# Altium schematic sheet systems_pcb.SchDoc
size A4; DocumentNumber: 1; SheetNumber: 1; SheetTotal: 5
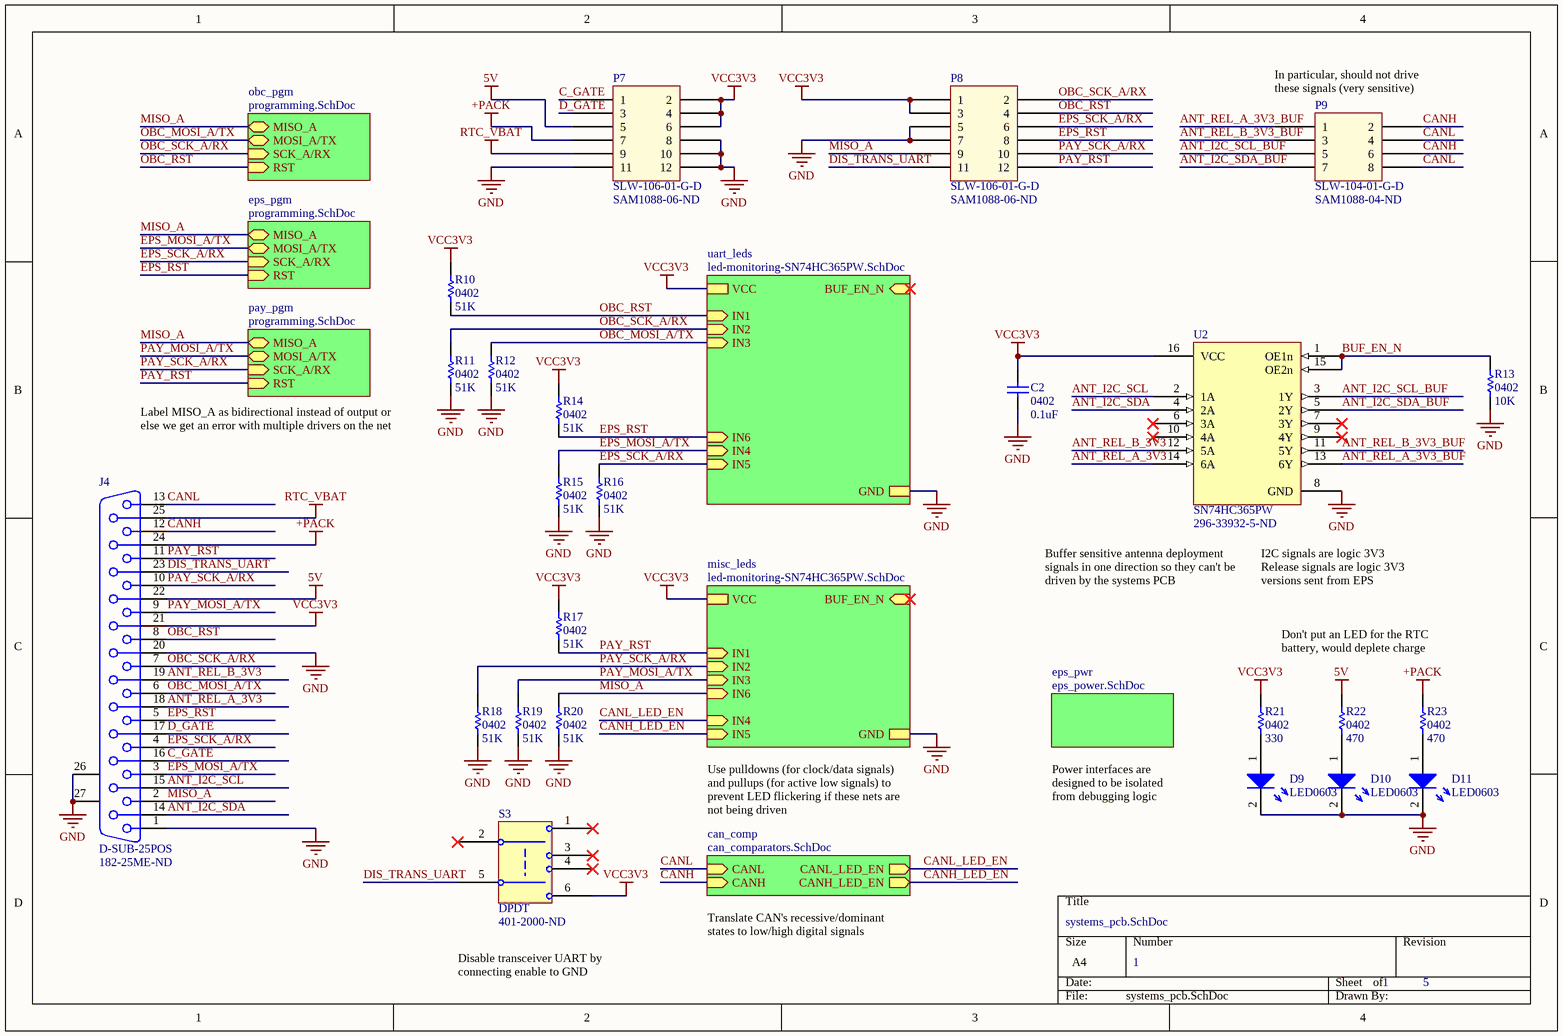
[diagram p0: systems_pcb.SchDoc]

## Parts
C2  0402  value 0.1uF  [CAP0402R]
D9  LED0603  [LED0603]
D10  LED0603  [LED0603]
D11  LED0603  [LED0603]
J4  D-SUB-25POS  Supplier Part Number 1: 182-25ME-ND  [D-SUB-25POS]
P7  SLW-106-01-G-D  Supplier Part Number 1: SAM1088-06-ND  [SLW-106-01-X-D]
P8  SLW-106-01-G-D  Supplier Part Number 1: SAM1088-06-ND  [SLW-106-01-X-D]
P9  SLW-104-01-G-D  Supplier Part Number 1: SAM1088-04-ND  [SLW-104-01-X-D]
R10  0402  value 51K  [RES0402R]
R11  0402  value 51K  [RES0402R]
R12  0402  value 51K  [RES0402R]
R13  0402  value 10K  [RES0402R]
R14  0402  value 51K  [RES0402R]
R15  0402  value 51K  [RES0402R]
R16  0402  value 51K  [RES0402R]
R17  0402  value 51K  [RES0402R]
R18  0402  value 51K  [RES0402R]
R19  0402  value 51K  [RES0402R]
R20  0402  value 51K  [RES0402R]
R21  0402  value 330  [RES0402R]
R22  0402  value 470  [RES0402R]
R23  0402  value 470  [RES0402R]
S3  DPDT  Supplier Part Number 1: 401-2000-ND  [JS202011AQN - Slide Switch]
U2  SN74HC365PW  Supplier Part Number 1: 296-33932-5-ND  [SOP65P640X120-16N]

## Sub-sheets
can_comp = can_comparators.SchDoc: CANL_LED_EN (out), CANH (in), CANH_LED_EN (out), CANL (in)
eps_pgm = programming.SchDoc: MISO_A (bidir), MOSI_A/TX (bidir), SCK_A/RX (in), RST (in)
eps_pwr = eps_power.SchDoc: no entries
misc_leds = led-monitoring-SN74HC365PW.SchDoc: VCC, GND, BUF_EN_N (in), IN1 (in), IN2 (in), IN3 (in), IN4 (in), IN5 (in), IN6 (in)
obc_pgm = programming.SchDoc: MISO_A (bidir), MOSI_A/TX (bidir), SCK_A/RX (in), RST (in)
pay_pgm = programming.SchDoc: MISO_A (bidir), MOSI_A/TX (bidir), SCK_A/RX (in), RST (in)
uart_leds = led-monitoring-SN74HC365PW.SchDoc: VCC, GND, BUF_EN_N (in), IN1 (in), IN2 (in), IN3 (in), IN4 (in), IN5 (in), IN6 (in)

## Nets
5V: J4.22 P7.5 R22.2
+PACK: J4.24 P7.7 R23.2
GND: C2.1 D9.2 D10.2 D11.2 J4.1 J4.20 J4.26(MH1) J4.27(MH2) P7.8 P7.10 P7.11 P7.12 P8.5 P8.7 R11.1 R12.1 R13.1 R15.1 R16.1 R18.1 R19.1 R20.1 U2.8(GND) ; sheet uart_leds/GND, sheet misc_leds/GND
RTC_VBAT: J4.25 P7.9
VCC3V3: C2.2 J4.21 P7.2 P7.4 P7.6 P8.1 P8.3 R10.2 R14.2 R17.2 R21.2 S3.6(POLE2B) U2.16(VCC) ; sheet uart_leds/VCC, sheet misc_leds/VCC
ANT_I2C_SCL: J4.15 U2.2(1A)
ANT_I2C_SCL_BUF: P9.5 U2.3(1Y)
ANT_I2C_SDA: J4.14 U2.4(2A)
ANT_I2C_SDA_BUF: P9.7 U2.5(2Y)
ANT_REL_A_3V3: J4.18 U2.14(6A)
ANT_REL_A_3V3_BUF: P9.1 U2.13(6Y)
ANT_REL_B_3V3: J4.19 U2.12(5A)
ANT_REL_B_3V3_BUF: P9.3 U2.11(5Y)
BUF_EN_N: R13.2 U2.1(OE1n) U2.15(OE2n)
C_GATE: J4.16 P7.1
CANH: J4.12 P9.2 P9.6 ; sheet can_comp/CANH
CANH_LED_EN: sheet misc_leds/IN5, sheet can_comp/CANH_LED_EN
CANL: J4.13 P9.4 P9.8 ; sheet can_comp/CANL
CANL_LED_EN: sheet misc_leds/IN4, sheet can_comp/CANL_LED_EN
D_GATE: J4.17 P7.3
DIS_TRANS_UART: J4.23 P8.11 S3.5(POLE2)
EPS_MOSI_A/TX: J4.3 R15.2 ; sheet eps_pgm/MOSI_A/TX, sheet uart_leds/IN4
EPS_RST: J4.5 P8.8 R14.1 ; sheet eps_pgm/RST, sheet uart_leds/IN6
EPS_SCK_A/RX: J4.4 P8.6 R16.2 ; sheet eps_pgm/SCK_A/RX, sheet uart_leds/IN5
MISO_A: J4.2 P8.9 R20.2 ; sheet obc_pgm/MISO_A, sheet eps_pgm/MISO_A, sheet pay_pgm/MISO_A, sheet misc_leds/IN6
OBC_MOSI_A/TX: J4.6 R12.2 ; sheet obc_pgm/MOSI_A/TX, sheet uart_leds/IN3
OBC_RST: J4.8 P8.4 R10.1 ; sheet obc_pgm/RST, sheet uart_leds/IN1
OBC_SCK_A/RX: J4.7 P8.2 R11.2 ; sheet obc_pgm/SCK_A/RX, sheet uart_leds/IN2
PAY_MOSI_A/TX: J4.9 R19.2 ; sheet pay_pgm/MOSI_A/TX, sheet misc_leds/IN3
PAY_RST: J4.11 P8.12 R17.1 ; sheet pay_pgm/RST, sheet misc_leds/IN1
PAY_SCK_A/RX: J4.10 P8.10 R18.2 ; sheet pay_pgm/SCK_A/RX, sheet misc_leds/IN2
NetD9_1: D9.1 R21.1
NetD10_1: D10.1 R22.1
NetD11_1: D11.1 R23.1

Not connected (* = marked no-connect by the designer): S3 1(POLE1A)* 2(POLE1)* 3(POLE1B)* 4(POLE2A)*; U2 6(3A)* 7(3Y)* 9(4Y)* 10(4A)*

## Notes on the sheet
- (near P9) In particular, should not drive these signals (very sensitive)
- Label MISO_A as bidirectional instead of output or else we get an error with multiple drivers on the net
- Buffer sensitive antenna deployment signals in one direction so they can't be driven by the systems PCB
- I2C signals are logic 3V3
  Release signals are logic 3V3 versions sent from EPS
- Don't put an LED for the RTC battery, would deplete charge
- Use pulldowns (for clock/data signals) and pullups (for active low signals) to prevent LED flickering if these nets are not being driven
- Power interfaces are designed to be isolated from debugging logic
- Disable transceiver UART by connecting enable to GND
- Translate CAN's recessive/dominant states to low/high digital signals

## Library data of the parts
C2 = CAP0402: 0402 capacitor; Manufacturer: Taiyo Yuden; Manufacturer Part Number: EMK105B7104KVHF; Voltage Rating: 16V; Capacitance: 100nF; Tolerance: 10%; Dielectric: X7R; Supplier 1: Digi-Key; Supplier Part Number 1: 587-3807-1-ND; Stock 1: 18196; Pricing 1: 1=0.1, 10=0.057, 100=0.0254, 500=0.01812, 1000=0.01423, 2500=0.01294, 5000=0.0119 (USD); Mount: Surface Mount; Case/Package: 0402; Weight: 2.3E-05oz; Case Code (Metric): 1005; Case Code (Imperial): 0402; Min Operating Temperature: -55°C; Max Operating Temperature: 125°C; Package Quantity: 10000; Packaging: Tape and Reel; Termination: SMD/SMT; Voltage Rating (DC): 16V; Length: 0.039inch; Height: 0.5mm; Width: 0.02inch; Thickness: 0.022inch; Ratings: AEC-Q200; Lead Free: Lead Free; Halogen Free: Halogen Free
D9-D11 = LED0603: Generic 0603 LED. Use ChipLED from Osram for generic ones.
J4 = D-SUB-25POS: CONN D-SUB PLUG 25POS R/A SOLDER; Supplier 1: Digi-Key; ComponentLink1Description: Datasheet; ComponentLink1URL: https://www.norcomp.net/rohspdfs/Connectors/18Y/182/182-yyy-113Ryy1.pdf
P7 P8 = SLW-106-01-G-D: CONN RCPT 12POS 0.1 GOLD PCB; Supplier 1: Digi-Key
P9 = SLW-104-01-G-D: CONN RCPT 8POS 0.1 GOLD PCB; Supplier 1: Digi-Key; ComponentLink1Description: Series Datasheet; ComponentLink1URL: http://suddendocs.samtec.com/prints/slw-1xx-01-x-x-mkt.pdf
R10-R12 R14-R23 = RES0402: 0402 resistor
R13 = RES0402: 0402 resistor; Manufacturer: Panasonic; Manufacturer Part Number: ERJ-2RKF1002X; Resistance: 10kR; Power Rating: 100mW; Tolerance: 1%; Voltage Rating: 50V; Temperature Coefficient: 100ppm/°C; Supplier 1: Digi-Key; Supplier Part Number 1: P10.0KLCT-ND; Stock 1: 14350001; Pricing 1: 1=0.1, 10=0.045, 100=0.0183, 1000=0.00823, 2500=0.00715, 5000=0.0059 (USD); Mount: Surface Mount; Case/Package: 0402; Number of Pins: 2; Case Code (Metric): 1005; Case Code (Imperial): 0402; Contact Plating: Tin; Min Operating Temperature: -55°C; Max Operating Temperature: 155°C; Packaging: Tape and Reel; Package Quantity: 1; Composition: Thick Film; Number of Terminations: 2; Termination: SMD/SMT; Military Standard: Not; Max Power Dissipation: 100mW; Voltage Rating (DC): 50V; Features: Automotive AEC-Q200; Length: 1mm; Height: 0.35mm; Width: 0.02inch; Depth: 0.5mm; Radiation Hardening: No; REACH SVHC: No SVHC; Lead Free: Lead Free; ComponentLink1URL: http://industrial.panasonic.com/www-data/pdf/AOA0000/AOA0000CE2.pdf?src-supplier=Future+Electronics; ComponentLink1Description: http://industrial.panasonic.com/www-data/pdf/AOA0000/AOA0000CE2.pdf?src-supplier=Future+Electronics; ComponentLink2URL: http://industrial.panasonic.com/www-data/pdf/AOA0000/AOA0000CE2.pdf?src-supplier=Avnet+Europe; ComponentLink2Description: http://industrial.panasonic.com/www-data/pdf/AOA0000/AOA0000CE2.pdf?src-supplier=Avnet+Europe; ComponentLink3URL: https://industrial.panasonic.com/cdbs/www-data/pdf/RDA0000/DMA0000COL11.pdf?src-supplier=Mouser; ComponentLink3Description: https://industrial.panasonic.com/cdbs/www-data/pdf/RDA0000/DMA0000COL11.pdf?src-supplier=Mouser; ComponentLink4URL: http://www.farnell.com/datasheets/1678782.pdf?src-supplier=Element14; ComponentLink4Description: http://www.farnell.com/datasheets/1678782.pdf?src-supplier=Element14; ComponentLink5URL: http://www.farnell.com/datasheets/1911175.pdf?src-supplier=Farnell; ComponentLink5Description: http://www.farnell.com/datasheets/1911175.pdf?src-supplier=Farnell; ComponentLink6URL: http://www.jameco.com/Jameco/Products/ProdDS/1987020.pdf?src-supplier=Jameco; ComponentLink6Description: http://www.jameco.com/Jameco/Products/ProdDS/1987020.pdf?src-supplier=Jameco; ComponentLink7URL: http://industrial.panasonic.com/www-data/pdf/AOA0000/AOA0000CE2.pdf?src-supplier=Avnet; ComponentLink7Description: http://industrial.panasonic.com/www-data/pdf/AOA0000/AOA0000CE2.pdf?src-supplier=Avnet; ComponentLink8URL: http://www.alliedelec.com/m/d/623f45ff1957d936ff56d46fd1c28cac.pdf?src-supplier=Allied+Electronics; ComponentLink8Description: http://www.alliedelec.com/m/d/623f45ff1957d936ff56d46fd1c28cac.pdf?src-supplier=Allied+Electronics
S3 = DPDT Switch: DPDT Switch, customized for the pinout of the JS202011AQN switch.; Supplier 1: Digi-Key
U2 = SN74HC365PW: Hex non-inverting buffer with 3-state outputs; Supplier 1: Digi-Key